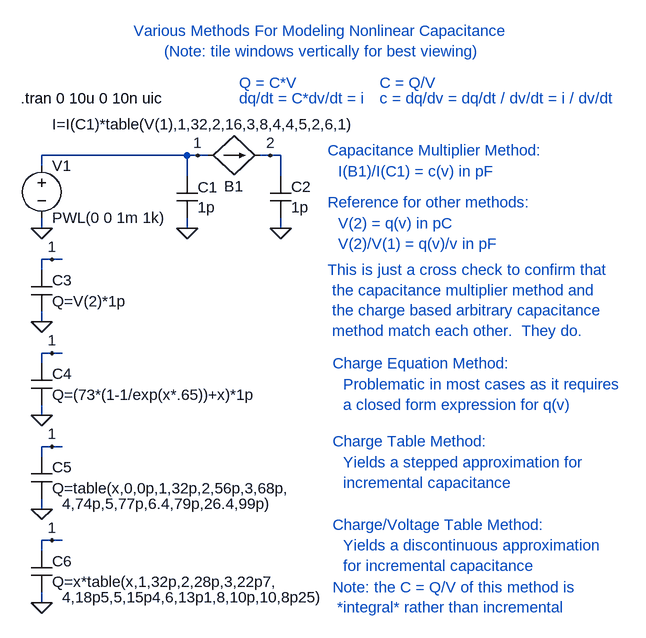
[diagram p0: schematic Nonlinear_Capacitor_Test.asc]
Nonlinear_Capacitor_Test.asc, the LTspice schematic file:
Version 4
SHEET 1 4000 828
WIRE -480 96 -480 80
WIRE -480 0 -480 -16
WIRE -480 -16 -256 -16
WIRE -256 -16 -256 16
WIRE -256 80 -256 96
WIRE -256 -16 -240 -16
WIRE -144 -16 -128 -16
WIRE -480 512 -480 528
WIRE -480 448 -480 432
WIRE -448 432 -464 432
WIRE -464 432 -480 432
WIRE -240 -16 -224 -16
WIRE -112 80 -112 96
WIRE -128 -16 -112 -16
WIRE -112 -16 -112 16
WIRE -480 656 -480 672
WIRE -480 592 -480 576
WIRE -448 576 -464 576
WIRE -464 576 -480 576
WIRE -480 368 -480 384
WIRE -480 304 -480 288
WIRE -448 288 -464 288
WIRE -464 288 -480 288
WIRE -480 224 -480 240
WIRE -480 160 -480 144
WIRE -448 144 -464 144
WIRE -464 144 -480 144
FLAG -480 96 0
FLAG -240 -16 1
FLAG -256 96 0
FLAG -112 96 0
FLAG -480 528 0
FLAG -464 432 1
FLAG -128 -16 2
FLAG -480 672 0
FLAG -464 576 1
FLAG -480 384 0
FLAG -464 288 1
FLAG -480 240 0
FLAG -464 144 1
SYMBOL voltage -480 -16 R0
WINDOW 3 16 96 Left 0
WINDOW 123 0 0 Left 0
WINDOW 39 0 0 Left 0
WINDOW 0 16 16 Left 0
SYMATTR Value PWL(0 0 1m 1k)
SYMATTR InstName V1
SYMBOL cap -272 16 R0
WINDOW 0 32 17 Left 0
WINDOW 3 32 48 Left 0
SYMATTR InstName C1
SYMATTR Value 1p
SYMBOL bi -224 -16 R270
WINDOW 0 -32 40 VBottom 0
WINDOW 3 48 -240 VRight 0
SYMATTR InstName B1
SYMATTR Value I=I(C1)*table(V(1),1,32,2,16,3,8,4,4,5,2,6,1)
SYMBOL cap -496 448 R0
WINDOW 0 32 16 Left 0
WINDOW 3 32 48 Left 0
WINDOW 123 48 72 Left 0
SYMATTR InstName C5
SYMATTR Value Q=table(x,0,0p,1,32p,2,56p,3,68p,
SYMATTR Value2 4,74p,5,77p,6.4,79p,26.4,99p)
SYMBOL cap -128 16 R0
WINDOW 0 32 16 Left 0
WINDOW 3 32 48 Left 0
SYMATTR InstName C2
SYMATTR Value 1p
SYMATTR Value2 IC=0
SYMBOL cap -496 592 R0
WINDOW 0 32 16 Left 0
WINDOW 3 32 48 Left 0
WINDOW 123 48 72 Left 0
SYMATTR InstName C6
SYMATTR Value Q=x*table(x,1,32p,2,28p,3,22p7,
SYMATTR Value2 4,18p5,5,15p4,6,13p1,8,10p,10,8p25)
SYMBOL cap -496 304 R0
WINDOW 0 32 16 Left 0
WINDOW 3 32 48 Left 0
SYMATTR InstName C4
SYMATTR Value Q=(73*(1-1/exp(x*.65))+x)*1p
SYMBOL cap -496 160 R0
WINDOW 0 32 16 Left 0
WINDOW 3 32 48 Left 0
WINDOW 123 48 72 Left 0
SYMATTR InstName C3
SYMATTR Value Q=V(2)*1p
TEXT -512 -104 Left 0 !.tran 0 10u 0 10n uic
TEXT -176 -104 Left 0 ;dq/dt = C*dv/dt = i
TEXT -176 -128 Left 0 ;Q = C*V
TEXT 40 -128 Left 0 ;C = Q/V
TEXT 40 -104 Left 0 ;c = dq/dv = dq/dt / dv/dt = i / dv/dt
TEXT -48 -192 Center 0 ;Various Methods For Modeling Nonlinear Capacitance\n(Note: tile windows vertically for best viewing)
TEXT -24 88 Left 0 ;V(2) = q(v) in pC
TEXT -24 8 Left 0 ;I(B1)/I(C1) = c(v) in pF
TEXT -24 120 Left 0 ;V(2)/V(1) = q(v)/v in pF
TEXT -40 -24 Left 0 ;Capacitance Multiplier Method:
TEXT -40 56 Left 0 ;Reference for other methods:
TEXT -32 304 Left 0 ;Charge Equation Method:
TEXT -16 336 Left 0 ;Problematic in most cases as it requires \na closed form expression for q(v)
TEXT -32 424 Left 0 ;Charge Table Method:
TEXT -16 456 Left 0 ;Yields a stepped approximation for \nincremental capacitance
TEXT -32 552 Left 0 ;Charge/Voltage Table Method:
TEXT -16 584 Left 0 ;Yields a discontinuous approximation \nfor incremental capacitance
TEXT -32 648 Left 0 ;Note: the C = Q/V of this method is\n *integral* rather than incremental
TEXT -40 160 Left 0 ;This is just a cross check to confirm that\n the capacitance multiplier method and\n the charge based arbitrary capacitance\n method match each other.  They do.

The netlist it stands for:
* Nonlinear_Capacitor_Test.asc
V1 1 0 PWL(0 0 1m 1k)
C1 1 0 1p
B1 1 2 I=I(C1)*table(V(1),1,32,2,16,3,8,4,4,5,2,6,1)
C5 1 0 Q=table(x,0,0p,1,32p,2,56p,3,68p, 4,74p,5,77p,6.4,79p,26.4,99p)
C2 2 0 1p IC=0
C6 1 0 Q=x*table(x,1,32p,2,28p,3,22p7, 4,18p5,5,15p4,6,13p1,8,10p,10,8p25)
C4 1 0 Q=(73*(1-1/exp(x*.65))+x)*1p
C3 1 0 Q=V(2)*1p
.tran 0 10u 0 10n uic
* dq/dt = C*dv/dt = i
* Q = C*V
* C = Q/V
* c = dq/dv = dq/dt / dv/dt = i / dv/dt
* Various Methods For Modeling Nonlinear Capacitance
* (Note: tile windows vertically for best viewing)
* V(2) = q(v) in pC
* I(B1)/I(C1) = c(v) in pF
* V(2)/V(1) = q(v)/v in pF
* Capacitance Multiplier Method:
* Reference for other methods:
* Charge Equation Method:
* Problematic in most cases as it requires
* a closed form expression for q(v)
* Charge Table Method:
* Yields a stepped approximation for
* incremental capacitance
* Charge/Voltage Table Method:
* Yields a discontinuous approximation
* for incremental capacitance
* Note: the C = Q/V of this method is
*  *integral* rather than incremental
* This is just a cross check to confirm that
*  the capacitance multiplier method and
*  the charge based arbitrary capacitance
*  method match each other.  They do.
.backanno
.end